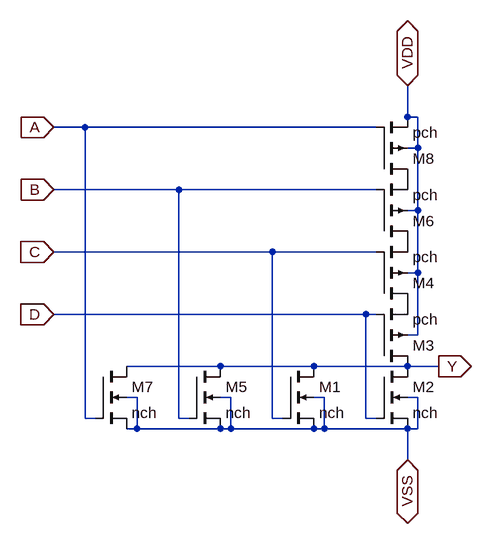
[diagram p0: schematic nor4.asc]
nor4.asc, the LTspice schematic file:
Version 4
SHEET 1 880 680
WIRE 272 -192 272 -240
WIRE 288 -192 272 -192
WIRE -224 -176 -272 -176
WIRE 224 -176 -224 -176
WIRE 288 -144 288 -192
WIRE 288 -144 272 -144
WIRE -80 -80 -272 -80
WIRE 224 -80 -80 -80
WIRE 288 -48 288 -144
WIRE 288 -48 272 -48
WIRE 64 16 -272 16
WIRE 224 16 64 16
WIRE 288 48 288 -48
WIRE 288 48 272 48
WIRE 208 112 -272 112
WIRE 224 112 208 112
WIRE 288 144 288 48
WIRE 288 144 272 144
WIRE -16 192 -160 192
WIRE 128 192 -16 192
WIRE 272 192 128 192
WIRE 320 192 272 192
WIRE -144 240 -160 240
WIRE 0 240 -16 240
WIRE 144 240 128 240
WIRE 288 240 272 240
WIRE -224 272 -224 -176
WIRE -208 272 -224 272
WIRE -80 272 -80 -80
WIRE -64 272 -80 272
WIRE 64 272 64 16
WIRE 80 272 64 272
WIRE 208 272 208 112
WIRE 224 272 208 272
WIRE -144 288 -144 240
WIRE -144 288 -160 288
WIRE -16 288 -144 288
WIRE 0 288 0 240
WIRE 0 288 -16 288
WIRE 128 288 0 288
WIRE 144 288 144 240
WIRE 144 288 128 288
WIRE 272 288 144 288
WIRE 288 288 288 240
WIRE 288 288 272 288
WIRE 272 336 272 288
FLAG -272 16 C
IOPIN -272 16 In
FLAG -272 112 D
IOPIN -272 112 In
FLAG 320 192 Y
IOPIN 320 192 Out
FLAG -272 -80 B
IOPIN -272 -80 In
FLAG -272 -176 A
IOPIN -272 -176 In
FLAG 272 336 VSS
IOPIN 272 336 BiDir
FLAG 272 -240 VDD
IOPIN 272 -240 BiDir
SYMBOL nmos4 80 192 R0
SYMATTR InstName M1
SYMATTR Value nch
SYMATTR Value2 l=ln w=wn
SYMBOL nmos4 224 192 R0
SYMATTR InstName M2
SYMATTR Value nch
SYMATTR Value2 l=ln w=wn
SYMBOL pmos4 224 192 M180
SYMATTR InstName M3
SYMATTR Value pch
SYMATTR Value2 l=lp w=wp
SYMBOL pmos4 224 96 M180
SYMATTR InstName M4
SYMATTR Value pch
SYMATTR Value2 l=lp w=wp
SYMBOL nmos4 -64 192 R0
SYMATTR InstName M5
SYMATTR Value nch
SYMATTR Value2 l=ln w=wn
SYMBOL pmos4 224 0 M180
SYMATTR InstName M6
SYMATTR Value pch
SYMATTR Value2 l=lp w=wp
SYMBOL nmos4 -208 192 R0
SYMATTR InstName M7
SYMATTR Value nch
SYMATTR Value2 l=ln w=wn
SYMBOL pmos4 224 -96 M180
SYMATTR InstName M8
SYMATTR Value pch
SYMATTR Value2 l=lp w=wp

The netlist it stands for:
* nor4.asc
M1 Y C VSS VSS nch l=ln w=wn
M2 Y D VSS VSS nch l=ln w=wn
M3 Y D P001 VDD pch l=lp w=wp
M4 P001 C P002 VDD pch l=lp w=wp
M5 Y B VSS VSS nch l=ln w=wn
M6 P002 B P003 VDD pch l=lp w=wp
M7 Y A VSS VSS nch l=ln w=wn
M8 P003 A VDD VDD pch l=lp w=wp
.model NMOS NMOS
.model PMOS PMOS
.lib standard.mos
.backanno
.end